# Altium schematic sheet Controller.SchDoc
size A4; SheetNumber: 1; SheetTotal: 1
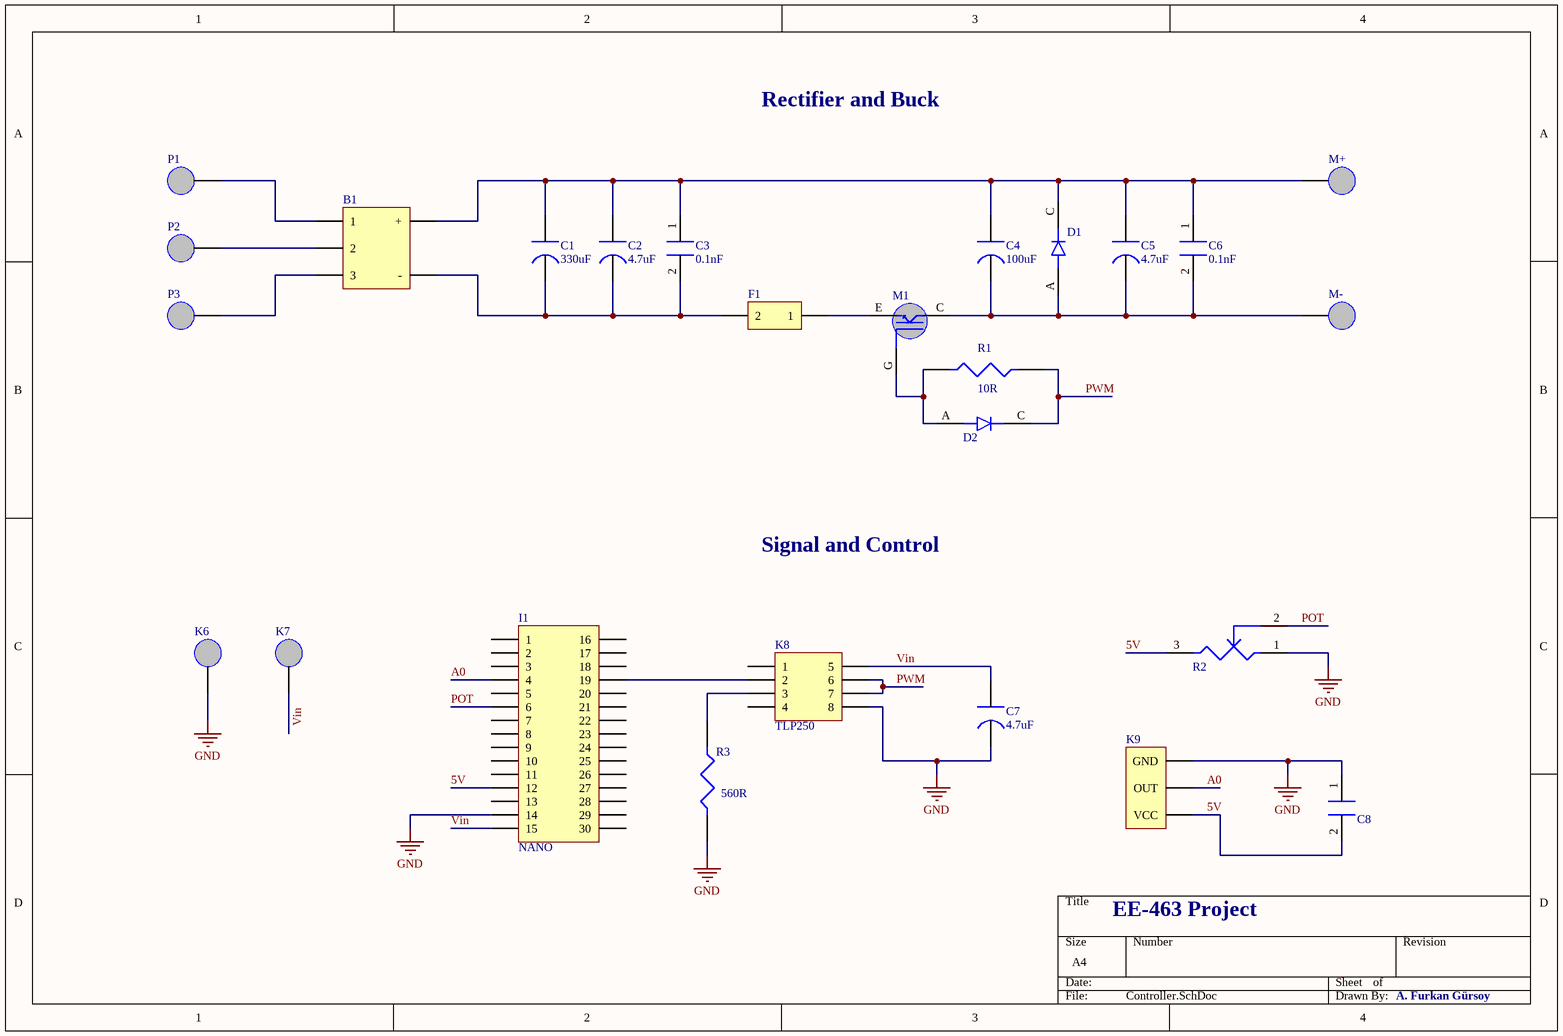
[diagram p0: Controller.SchDoc]

## Parts
B1  B?  [36mt160]  (value not drawn)
C1  330uF  [330uF400V]
C2  4.7uF  [4.7uF400V]
C3  0.1nF  [0.1nf1000V]
C4  100uF  [100uF400V]
C5  4.7uF  [4.7uF400V]
C6  0.1nF  [0.1nf1000V]
C7  4.7uF  [4.7uF400V]
C8  C8  [0.1nf1000V]
D1  D?  [Heatsınk+Dıyot]  (value not drawn)
D2  D2  [Diode-DIP]
F1  F?  [Sıgorta]  (value not drawn)
I1  NANO  [Nano]
K6  K6  [4mm Konnektor]
K7  K7  [4mm Konnektor]
K8  TLP250  [8DIP]
K9  K?  [ACS]  (value not drawn)
M1  M?  [Heatsink+IGBT]  (value not drawn)
M+  K?  [4mm Konnektor]  (value not drawn)
M-  K?  [4mm Konnektor]  (value not drawn)
P1  K?  [4mm Konnektor]  (value not drawn)
P2  K?  [4mm Konnektor]  (value not drawn)
P3  K?  [4mm Konnektor]  (value not drawn)
R1  10R  [10R]
R2  R2  [POT]
R3  560R  [10R]

## Nets
GND: C7.2 C8.1 I1.14 K6.1 K8.8 K9.GND R2.1 R3.1
5V: C8.2 I1.12 K9.VCC R2.3
A0: I1.4 K9.OUT
POT: I1.6 R2.2
PWM: D2.C K8.6 K8.7 R1.1
Vin: C7.1 I1.15 K7.1 K8.5
NetB1_1: B1.1 P1.1
NetB1_2: B1.2 P2.1
NetB1_3: B1.3 P3.1
NetB1_+: B1.+ C1.1 C2.1 C3.1 C4.1 C5.1 C6.1 D1.C M+.1
NetB1_-: B1.- C1.2 C2.2 C3.2 F1.2
NetC4_2: C4.2 C5.2 C6.2 D1.A M1.C M-.1
NetD2_A: D2.A M1.G R1.2
NetF1_1: F1.1 M1.E
NetI1_19: I1.19 K8.2
NetK8_3: K8.3 R3.2

Not connected (* = marked no-connect by the designer): I1 1 2 3 5 7 8 9 10 11 13 16 17 18 20 21 22 23 24 25 26 27 28 29 30; K8 1 4

## Notes on the sheet
- Rectifier and Buck
- Signal and Control
- EE-463 Project
- A. Furkan Gürsoy

## Library data of the parts
B1 = 36MT160
C1 = 330uF400V
C2 C5 C7 = 4.7uF400V
C3 C6 C8 = 0.1nF1000V
C4 = 100uF400V
D1 = Heatsink+Diyot
D2 = Diyot
F1 = Sigorta
K6 K7 M+ M- P1-P3 = 4mmKonnektor
K8 = 8DIPSoket
K9 = ACS
M1 = Heatsink+IGBT
R2 = POT
R3 = 10R